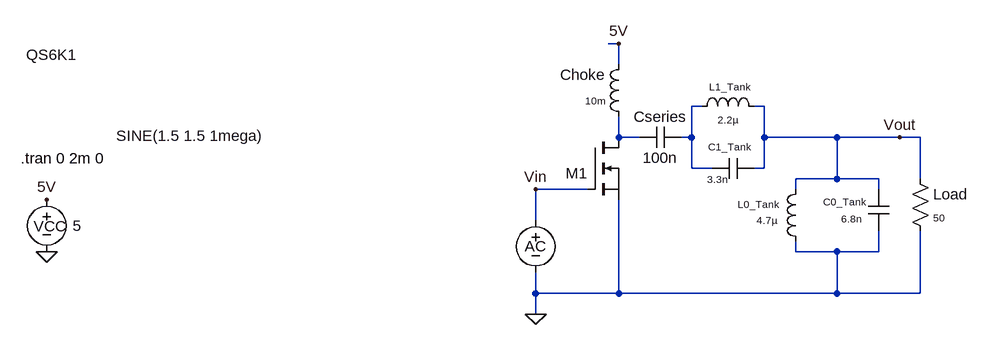
[diagram p0: schematic CLASS F Amplifier.asc]
CLASS F Amplifier.asc, the LTspice schematic file:
Version 4
SHEET 1 912 680
WIRE 256 -128 240 -128
WIRE 256 -96 256 -128
WIRE 384 -32 368 -32
WIRE 480 -32 464 -32
WIRE 256 16 256 -16
WIRE 288 16 256 16
WIRE 368 16 368 -32
WIRE 368 16 352 16
WIRE 480 16 480 -32
WIRE 592 16 480 16
WIRE 688 16 592 16
WIRE 720 16 688 16
WIRE 368 64 368 16
WIRE 400 64 368 64
WIRE 480 64 480 16
WIRE 480 64 464 64
WIRE 592 80 592 16
WIRE 592 80 528 80
WIRE 656 80 592 80
WIRE 720 80 720 16
WIRE 208 96 128 96
WIRE 528 96 528 80
WIRE 656 96 656 80
WIRE 128 144 128 96
WIRE 528 192 528 176
WIRE 592 192 528 192
WIRE 656 192 656 160
WIRE 656 192 592 192
WIRE 128 256 128 224
WIRE 256 256 256 112
WIRE 256 256 128 256
WIRE 592 256 592 192
WIRE 592 256 256 256
WIRE 720 256 720 160
WIRE 720 256 592 256
WIRE 128 288 128 256
FLAG 256 -128 5V
FLAG 688 16 Vout
FLAG -624 112 5V
FLAG -624 192 0
FLAG 128 96 Vin
FLAG 128 288 0
SYMBOL voltage 128 128 R0
WINDOW 123 0 0 Left 0
WINDOW 39 0 0 Left 0
WINDOW 0 -17 56 Left 2
WINDOW 3 -645 -114 Left 2
SYMATTR InstName AC
SYMATTR Value SINE(1.5 1.5 1mega)
SYMBOL voltage -624 96 R0
WINDOW 0 -20 57 Left 2
WINDOW 3 40 56 Left 2
WINDOW 123 0 0 Left 0
WINDOW 39 0 0 Left 0
SYMATTR InstName VCC
SYMATTR Value 5
SYMBOL nmos 208 16 R0
WINDOW 0 -34 55 Left 2
WINDOW 3 -864 -127 Left 2
SYMATTR InstName M1
SYMATTR Value QS6K1
SYMBOL ind 368 -16 R270
WINDOW 0 35 59 VTop 1
WINDOW 3 5 56 VBottom 1
SYMATTR InstName L1_Tank
SYMATTR Value 2.2µ
SYMATTR SpiceLine Ipk=20
SYMBOL res 704 64 R0
WINDOW 3 36 76 Left 1
SYMATTR InstName Load
SYMATTR Value 50
SYMBOL cap 352 0 R90
WINDOW 0 0 32 VBottom 2
WINDOW 3 32 32 VTop 2
SYMATTR InstName Cseries
SYMATTR Value 100n
SYMBOL ind 272 0 R180
WINDOW 0 36 80 Left 2
WINDOW 3 36 40 Left 1
SYMATTR InstName Choke
SYMATTR Value 10m
SYMATTR SpiceLine Ipk=20 Rser=1 Cpar=0
SYMBOL cap 464 48 R90
WINDOW 0 -7 38 VBottom 1
WINDOW 3 22 56 VTop 1
SYMATTR InstName C1_Tank
SYMATTR Value 3.3n
SYMBOL ind 544 192 R180
WINDOW 0 42 73 Left 1
WINDOW 3 44 48 Left 1
SYMATTR InstName L0_Tank
SYMATTR Value 4.7µ
SYMATTR SpiceLine Ipk=20
SYMBOL cap 672 160 R180
WINDOW 0 36 45 Left 1
WINDOW 3 42 19 Left 1
SYMATTR InstName C0_Tank
SYMATTR Value 6.8n
SYMATTR SpiceLine Rpar=0
TEXT -664 48 Left 2 !.tran 0 2m 0

The netlist it stands for:
* CLASS F Amplifier.asc
V§AC Vin 0 SINE(1.5 1.5 1mega)
VCC 5V 0 5
M1 N002 Vin 0 0 QS6K1
L1_Tank N001 Vout 2.2µ Ipk=20
R§Load Vout 0 50
Cseries N001 N002 100n
L§Choke N002 5V 10m Ipk=20 Rser=1 Cpar=0
C1_Tank Vout N001 3.3n
L0_Tank 0 Vout 4.7µ Ipk=20
C0_Tank 0 Vout 6.8n Rpar=0
.model NMOS NMOS
.model PMOS PMOS
.lib standard.mos
.tran 0 2m 0
.backanno
.end